# Altium project motherboard-25.PrjPcb
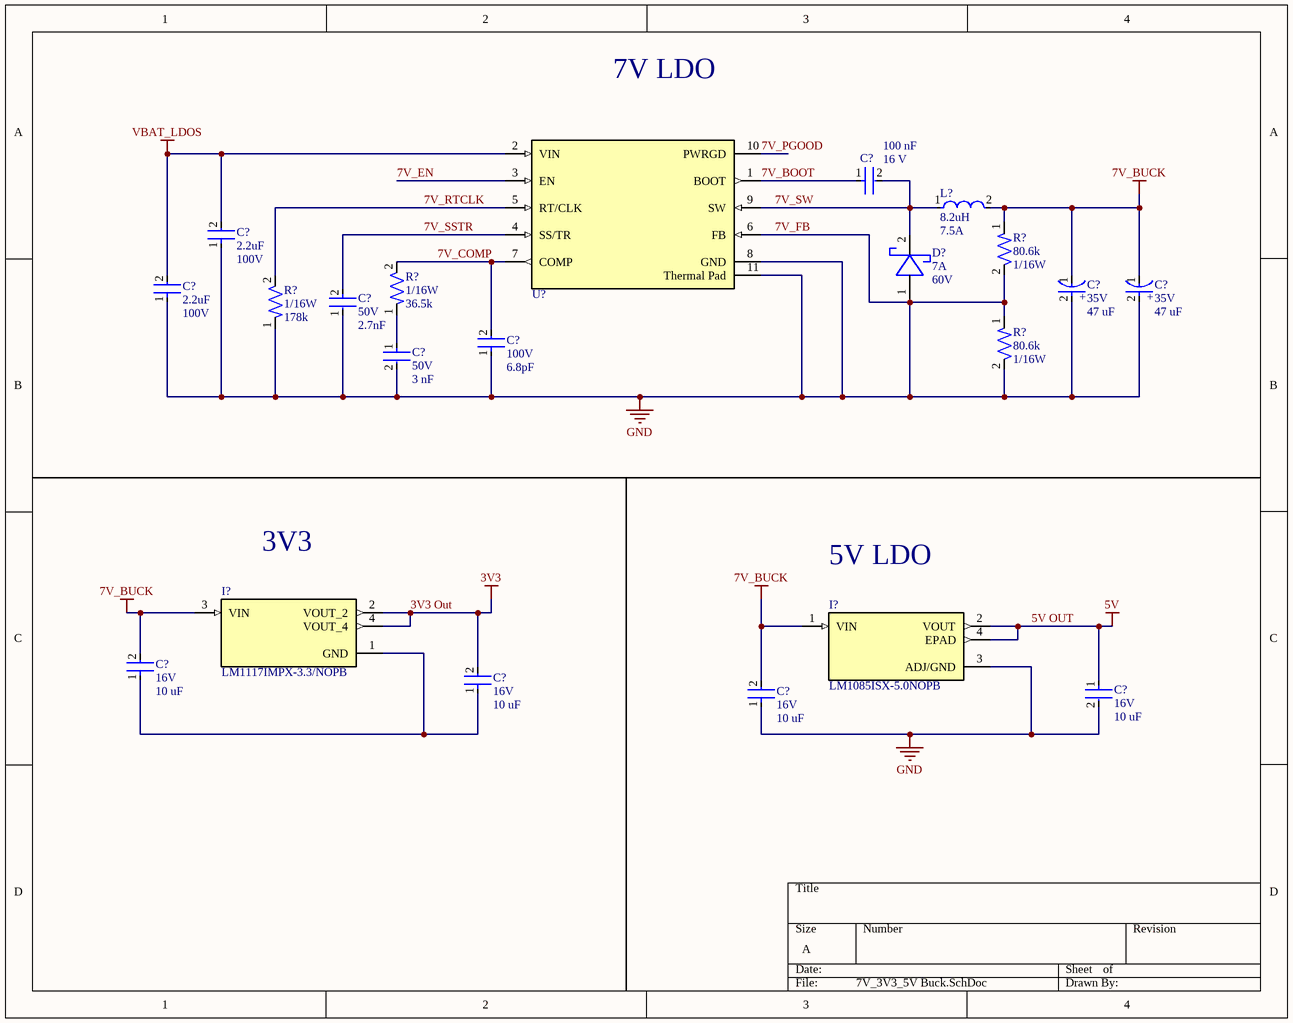
[diagram p0: 7V_3V3_5V Buck.SchDoc]
3 sheets, 27 parts. Net scope: flat (ports and power ports of the same name join across sheets).
Sheets:
  7V_3V3_5V Buck.SchDoc
  CAN.SchDoc
  MCU.SchDoc

## Sheet 7V_3V3_5V Buck.SchDoc
size A; SheetNumber: 3; SheetTotal: 3

### Parts
(Parts that share a designator on the sheet are numbered #1, #2 ... from top to bottom, then left to right.)
C?#1  Voltage Rating: 16 V  Capacitance: 100 nF  [CAP-0402]  (hidden comment: CC0402KRX7R7BB104)
C?#2  Capacitance: 2.2uF  Voltage: 100V  [CAP-1206]  (hidden comment: CC1206KKX7R0BB225)
C?#3  Voltage: 35V  Capacitance: 47 uF  [CAP-Radial-SMD]  (hidden comment: EEH-ZC1V470P)
C?#4  Voltage: 35V  Capacitance: 47 uF  [CAP-Radial-SMD]  (hidden comment: EEH-ZC1V470P)
C?#5  Capacitance: 2.2uF  Voltage: 100V  [CAP-1206]  (hidden comment: CC1206KKX7R0BB225)
C?#6  Voltage: 50V  Capacitance: 2.7nF  [CAP-0805]  (hidden comment: GRM2165C1H272JA01D)
C?#7  Voltage: 50V  Capacitance: 3 nF  [CAP-0603]  (hidden comment: GRM1885C1H302JA01D)
C?#8  Voltage: 100V  Capacitance: 6.8pF  [CAP-0603]  (hidden comment: CC0603CRNPO0BN6R8)
C?#9  Voltage: 16V  Capacitance: 10 uF  [CAP-1206]  (hidden comment: 293D106X9016A2TE3)
C?#10  Voltage: 16V  Capacitance: 10 uF  [CAP-1206]  (hidden comment: 293D106X9016A2TE3)
C?#11  Voltage: 16V  Capacitance: 10 uF  [CAP-1206]  (hidden comment: 293D106X9016A2TE3)
C?#12  Voltage: 16V  Capacitance: 10 uF  [CAP-1206]  (hidden comment: 293D106X9016A2TE3)
D?  Forward Current: 7A  Reverse Voltage (DC): 60V  [DO-POWERDI5]  (hidden comment: PDS760-13)
I?#1  LM1117IMPX-3.3/NOPB  [IC-SOT-223-4]
I?#2  LM1085ISX-5.0NOPB  [IC-TO-263-4]
L?  Inductance: 8.2uH  Current Rating: 7.5A  [IND25X25CZ]  (hidden comment: IHLP2525CZER8R2M01)
R?#1  Resistance: 80.6k  Power: 1/16W  [RES-0402]  (hidden comment: RC0402FR-0780K6L)
R?#2  Power: 1/16W  Resistance: 36.5k  [RES-0402]  (hidden comment: RC0402FR-0736K5L)
R?#3  Resistance: 80.6k  Power: 1/16W  [RES-0402]  (hidden comment: RC0402FR-0780K6L)
R?#4  Power: 1/16W  Resistance: 178k  [RES-0402]  (hidden comment: RTT021783FTH)
U?#1  TPS54561DPRR  [FP-DPR0010A-MFG]  (value not drawn)

### Nets
3V3 Out: C?#11.2 I?#1.2(VOUT_2) I?#1.4(VOUT_4)  [also labelled 3V3]
5V OUT: C?#10.1 I?#2.2(VOUT) I?#2.4(EPAD)  [also labelled 5V]
7V_BUCK: C?#3.1(C) C?#4.1(C) C?#9.2 C?#12.2 I?#1.3(VIN) I?#2.1(VIN) L?.2 R?#1.1
7V_FB: C?#2.1 C?#3.2(A) C?#4.2(A) C?#5.1 C?#6.1 C?#7.2 C?#8.1 C?#10.2 C?#12.1 D?.1(CATHODE) I?#2.3(ADJ/GND) R?#1.2 R?#3.1 R?#3.2 R?#4.1 U?#1.6(FB) U?#1.8(GND) U?#1.11(Thermal_Pad)  [also labelled GND]
VBAT_LDOS: C?#2.2 C?#5.2 U?#1.2(VIN)
7V_BOOT: C?#1.1 U?#1.1(BOOT)
7V_COMP: C?#8.2 R?#2.2 U?#1.7(COMP)
7V_EN: U?#1.3(EN)
7V_PGOOD: U?#1.10(PWRGD)
7V_RTCLK: R?#4.2 U?#1.5(RT/CLK)
7V_SSTR: C?#6.2 U?#1.4(SS/TR)
7V_SW: C?#1.2 D?.2(ANODE) L?.1 U?#1.9(SW)
NetC?#7_1: C?#7.1 R?#2.1
NetC?#9_1: C?#9.1 C?#11.1 I?#1.1(GND)

### Notes on the sheet
- 7V LDO
- 3V3
- 5V LDO
- (in symbol CAP-47U-0002) +

### Library data of the parts
C?#1 = CAP-0.1U-0001: CAP CER 0.1UF 16V X7R 0402; ComponentLink2Description: Datasheet; ComponentLink2URL: https://www.yageo.com/upload/media/product/productsearch/datasheet/mlcc/UPY-GPHC_X7R_6.3V-to-250V_24.pdf; Device Class: Ceramic; Size: 0402
C?#2 C?#5 = CAP-2.2U-0001: CAP CER 2.2UF 100V X7R 1206; Device Class: Ceramic; Size: 1206; ComponentLink1Description: Datasheet; ComponentLink1URL: https://www.yageo.com/upload/media/product/productsearch/datasheet/mlcc/UPY-GPHC_X7R_6.3V-to-250V_24.pdf
C?#3 C?#4 = CAP-47U-0002: CAP ALUM HYBRID 47UF 20% 35V SMD; Device Class: Electrolytic; ComponentLink1Description: Datasheet; ComponentLink1URL: https://industrial.panasonic.com/cdbs/www-data/pdf/RDD0000/ABA0000C1234.pdf
C?#6 = CAP-2.7N-0001: CAP CER 2700PF 50V C0G/NP0 0805; ComponentLink1Description: Datasheet; ComponentLink1URL: https://search.murata.co.jp/Ceramy/image/img/A01X/G101/ENG/GRM2165C1H272JA01-01.pdf; Device Class: Ceramic; Size: 0805
C?#7 = CAP-3N-0001: 3000 pF ±5% 50V Ceramic Capacitor C0G, NP0 0603 (1608 Metric); Device Class: Ceramic; Size: 1210; ComponentLink1Description: Datasheet; ComponentLink1URL: https://mm.digikey.com/Volume0/opasdata/d220001/medias/docus/41/CL32B106KBJNNNE_Spec.pdf
C?#8 = CAP-6.8P-0001: CAP CER 6.8PF 100V C0G/NPO 0603; Device Class: Ceramic; ComponentLink1Description: Datasheet; ComponentLink1URL: https://www.yageo.com/upload/media/product/productsearch/datasheet/mlcc/UPY-GPHC_X7R_6.3V-to-250V_24.pdf; Size: 0603
C?#9-C?#12 = CAP-10U-0004: CAP TANT 10UF 10% 16V 1206; Device Class: Tantalum; Size: 1206; ComponentLink1Description: Datasheet; ComponentLink1URL: https://www.lcsc.com/datasheet/lcsc_datasheet_2304140030_Vishay-Intertech-293D106X9016A2TE3_C110038.pdf
D? = DIO-SCHOTTKY-0001: DIODE SCHOTTKY 60V 7A POWERDI5; ComponentLink1Description: Datasheet; ComponentLink1URL: https://www.diodes.com/assets/Datasheets/PDS760.pdf
I?#1 = IC_LDO_3V3_0001: IC REG LIN 3.3V 800MA SOT223-4; ComponentLink1Description: New link; ComponentLink1URL: https://www.ti.com/lit/ds/symlink/lm1117.pdf?HQS=dis-dk-null-digikeymode-dsf-pf-null-wwe&ts=1721700739746
I?#2 = IC_LDO_5V_0002: IC REG LIN 5V 3A DDPAK/TO263-3; Mfr_Name: Texas Instruments; RefDes: RefDes; Type: Type; ComponentLink1Description: Datasheet; ComponentLink1URL: https://www.ti.com/lit/ds/symlink/lm1085.pdf?HQS=dis-dk-null-digikeymode-dsf-pf-null-wwe&ts=1729859809163&ref_url=https%253A%252F%252Fwww.ti.com%252Fgeneral%252Fdocs%252Fsuppproductinfo.tsp%253FdistId%253D10%2526gotoUrl%253Dhttps%253A%252F%252Fwww.ti.com%252Flit%252Fgpn%252Flm1085
L? = IND-8.2U-0001: 8.2 µH Shielded Molded Inductor 4 A 68mOhm Max Nonstandard; ComponentLink1Description: Datasheet; ComponentLink1URL: https://products.sumida.com/products/pdf/CDRH104.pdf
R?#1 R?#3 = RES-80.6k-0001: 80.6 kOhms ±1% 0.063W, 1/16W Chip Resistor 0402 (1005 Metric) Moisture Resistant Thick Film; Tolerance: 1%; Size: 0402; ComponentLink1Description: Datasheet; ComponentLink1URL: https://www.yageo.com/upload/media/product/products/datasheet/rchip/PYu-RC_Group_51_RoHS_L_12.pdf
R?#2 = RES-36.5k-0001: 36.5 kOhms ±1% 0.063W, 1/16W Chip Resistor 0402 (1005 Metric) Moisture Resistant Thick Film; Parameter 1: *
R?#4 = RES-178k-0001: 62.5mW Thick Film Resistors 50V ±100ppm/℃ ±1% 178kΩ 0402 Chip Resistor - Surface Mount ROHS; Tolerance: 1%; Size: 0402; ComponentLink1Description: Datasheet; ComponentLink1URL: https://www.lcsc.com/datasheet/lcsc_datasheet_2304140030_RALEC-RTT021783FTH_C102842.pdf
U?#1 = IC-BUCK-0001: IC REG BCK SPLIT RAIL ADJ 10WSON; Number of Outputs: 1; Output Type: Adjustable; Max Output Current: 5A; Output Voltage: 59V; Quiescent Current: 152uA; Synchronous Rectifier: No; Switching Frequency: 2.5MHz; Min Input Voltage: 4.5V; Max Input Voltage: 60V; Min Output Voltage: 800mV; Output Configuration: Positive; Max Operating Temperature: 125°C; Radiation Hardening: No; Number of Pins: 10; RoHS Compliant: Yes; Min Operating Temperature: -40°C; Lead Free: Lead Free; Package Quantity: 3000; Packaging: Tape and Reel; Mount: Surface Mount; Max Output Voltage: 59V; Output Current: 5A; Operating Supply Voltage: 60V

## Sheet CAN.SchDoc
size A; SheetNumber: 2; SheetTotal: 3
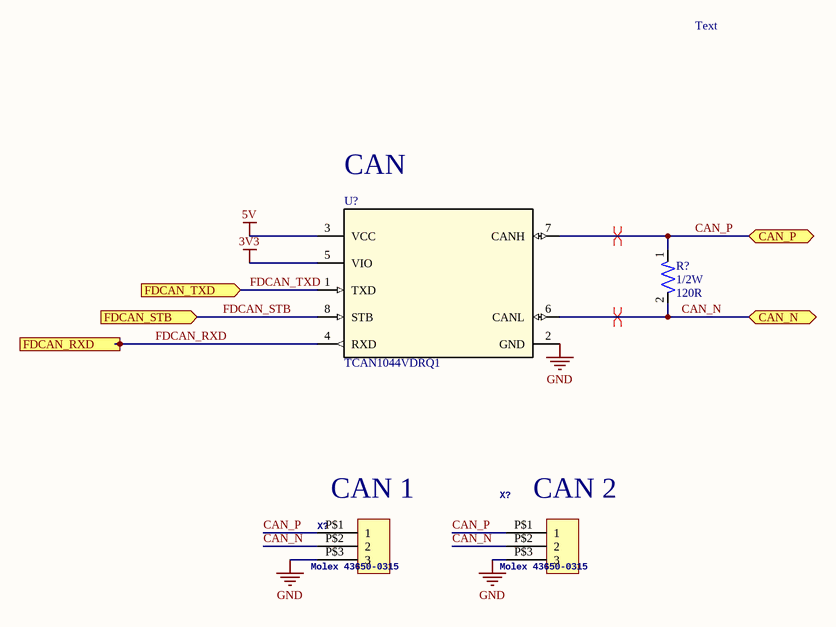
[diagram p1: CAN.SchDoc]

### Parts
(Parts that share a designator on the sheet are numbered #1, #2 ... from top to bottom, then left to right.)
R?#5  Power: 1/2W  Resistance: 120R  [RES-1210]  (hidden comment: RC1210FR-07120RL)
U?#2  TCAN1044VDRQ1  [IC-8SOIC]
X?#1  Molex 43650-0315  [43650-0315]
X?#2  Molex 43650-0315  [43650-0315]

### Ports
CAN_N (bidir), CAN_P (bidir), FDCAN_RXD (out), FDCAN_STB (in), FDCAN_TXD (in)

### Nets
3V3: U?#2.5(VIO)  [project net 3V3 Out]
5V: U?#2.3(VCC)  [project net 5V OUT]
GND: U?#2.2(GND) X?#1.P$3(3) X?#2.P$3(3)  [project net 7V_FB]
CAN_N: R?#5.2 U?#2.6(CANL) X?#1.P$2(2) X?#2.P$2(2) ; port CAN_N
CAN_P: R?#5.1 U?#2.7(CANH) X?#1.P$1(1) X?#2.P$1(1) ; port CAN_P
FDCAN_RXD: U?#2.4(RXD) ; port FDCAN_RXD
FDCAN_STB: U?#2.8(STB) ; port FDCAN_STB
FDCAN_TXD: U?#2.1(TXD) ; port FDCAN_TXD

### Layout directives
differential pair: CAN_N, CAN_P

### Notes on the sheet
- Text
- CAN
- (near X?#1) CAN 1
- (near X?#2) CAN 2

### Library data of the parts
R?#5 = RES-120-0001: RES 120 OHM 1% 1/2W 1210; Tolerance: 1%; Size: 1210; ComponentLink1Description: Datasheet; ComponentLink1URL: https://www.yageo.com/upload/media/product/products/datasheet/rchip/PYu-RC_Group_51_RoHS_L_12.pdf
U?#2 = IC-CAN-0001: IC TRANSCEIVER 1/1 8SOIC; ComponentLink1Description: Datasheet; ComponentLink1URL: https://www.ti.com/lit/ds/symlink/tcan1044-q1.pdf?HQS=dis-dk-null-digikeymode-dsf-pf-null-wwe&ts=1728758303289&ref_url=https%253A%252F%252Fwww.ti.com%252Fgeneral%252Fdocs%252Fsuppproductinfo.tsp%253FdistId%253D10%2526gotoUrl%253Dhttps%253A%252F%252Fwww.ti.com%252Flit%252Fgpn%252Ftcan1044-q1
X?#1 X?#2 = Micro-Fit Molex 3 Pin Vertical: GateName_1: G$1; SymbolName_1: HEADER_POS3; DeviceSetName: HEADER_POS3_?; DeviceName: 43650-0315; LibraryName: con-molex-micro-fit-3_0_2; Package: 43650-0315

## Sheet MCU.SchDoc
size A; SheetNumber: 3; SheetTotal: 3
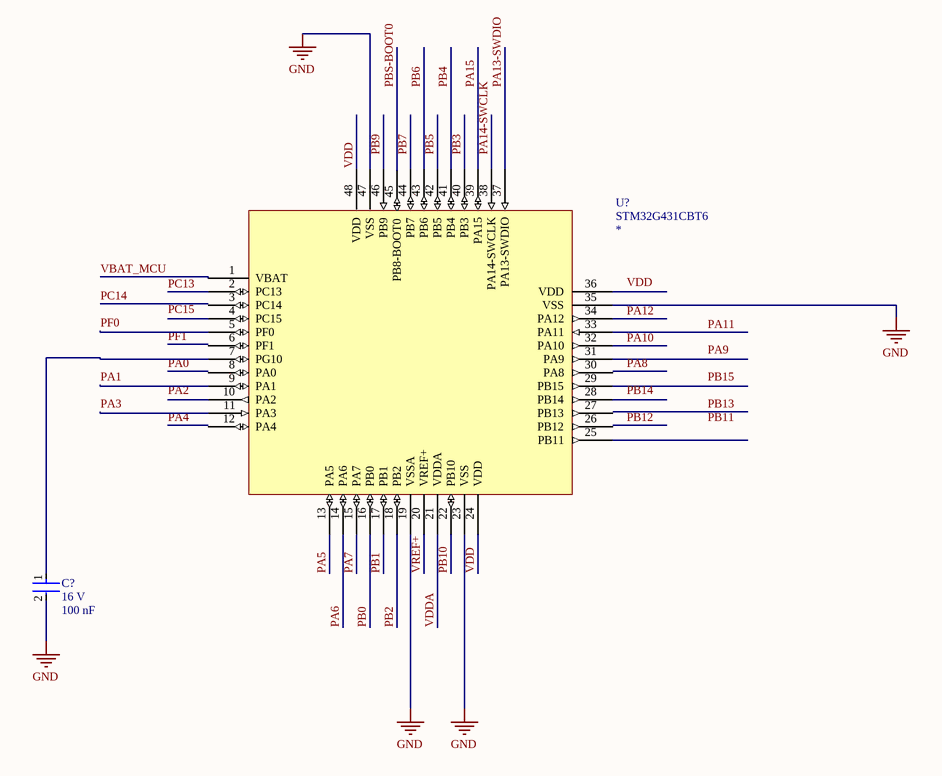
[diagram p2: MCU.SchDoc]

### Parts
(Parts that share a designator on the sheet are numbered #1, #2 ... from top to bottom, then left to right.)
C?#13  Voltage Rating: 16 V  Capacitance: 100 nF  [CAP-0402]  (hidden comment: CC0402KRX7R7BB104)
U?#3  STM32G431CBT6  [LQFP48-7x7mm]

### Nets
GND: C?#13.2 U?#3.19(VSSA) U?#3.23(VSS) U?#3.35(VSS) U?#3.47(VSS)  [project net 7V_FB]
PA1: U?#3.9(PA1)
PA3: U?#3.11(PA3)
PA5: U?#3.13(PA5)
PA6: U?#3.14(PA6)
PA7: U?#3.15(PA7)
PA10: U?#3.32(PA10)
PA11: U?#3.33(PA11)
PA12: U?#3.34(PA12)
PA13-SWDIO: U?#3.37(PA13-SWDIO)
PA14-SWCLK: U?#3.38(PA14-SWCLK)
PA15: U?#3.39(PA15)
PB0: U?#3.16(PB0)
PB1: U?#3.17(PB1)
PB2: U?#3.18(PB2)
PB3: U?#3.40(PB3)
PB4: U?#3.41(PB4)
PB5: U?#3.42(PB5)
PB6: U?#3.43(PB6)
PB7: U?#3.44(PB7)
PB9: U?#3.46(PB9)
PB10: U?#3.22(PB10)
PBS-BOOT0: U?#3.45(PB8-BOOT0)
PC13: U?#3.2(PC13)
PF0: U?#3.5(PF0)
VBAT_MCU: U?#3.1(VBAT)
VDD: U?#3.24(VDD) U?#3.48(VDD)
VDDA: U?#3.21(VDDA)
VREF+: U?#3.20(VREF+)
NetC?#13_1: C?#13.1 U?#3.7(PG10)

Not connected (* = marked no-connect by the designer): U?#3 3(PC14) 4(PC15) 6(PF1) 8(PA0) 10(PA2) 12(PA4) 25(PB11) 26(PB12) 27(PB13) 28(PB14) 29(PB15) 30(PA8) 31(PA9) 36(VDD)

### Notes on the sheet
- Labels drawn without touching a wire or pin: PA2, PA9, PB11, PB14, PB15, PC15, VDD

### Library data of the parts
C?#13 = CAP-0.1U-0001: CAP CER 0.1UF 16V X7R 0402; ComponentLink2Description: Datasheet; ComponentLink2URL: https://www.yageo.com/upload/media/product/productsearch/datasheet/mlcc/UPY-GPHC_X7R_6.3V-to-250V_24.pdf; Device Class: Ceramic; Size: 0402
U?#3 = IC-STM32G431CBT6: ARM® Cortex®-M4F STM32G4 Microcontroller IC 32-Bit Single-Core 170MHz 128KB (128K x 8) FLASH 48-LQFP (7x7); Parameter 1: *

## Nets that join several sheets
3V3 Out: 7V_3V3_5V Buck (C?#11.2 I?#1.2 I?#1.4), CAN (U?#2.5)
5V OUT: 7V_3V3_5V Buck (C?#10.1 I?#2.2 I?#2.4), CAN (U?#2.3)
7V_FB: 7V_3V3_5V Buck (18 pins), CAN (U?#2.2 X?#1.P$3 X?#2.P$3), MCU (5 pins)